# EasyEDA Pro project MORSEY_SOURCE.epro

# Schematic Schematic1
Board Name: Board1; Create Date: 2026-06-15; Page Name: P1; Project Name: MORSE CODE; Schematic Name: Schematic1; Update Date: 2026-06-15; Company: EasyEDA.com; Page Size: A4; Version: V1.0
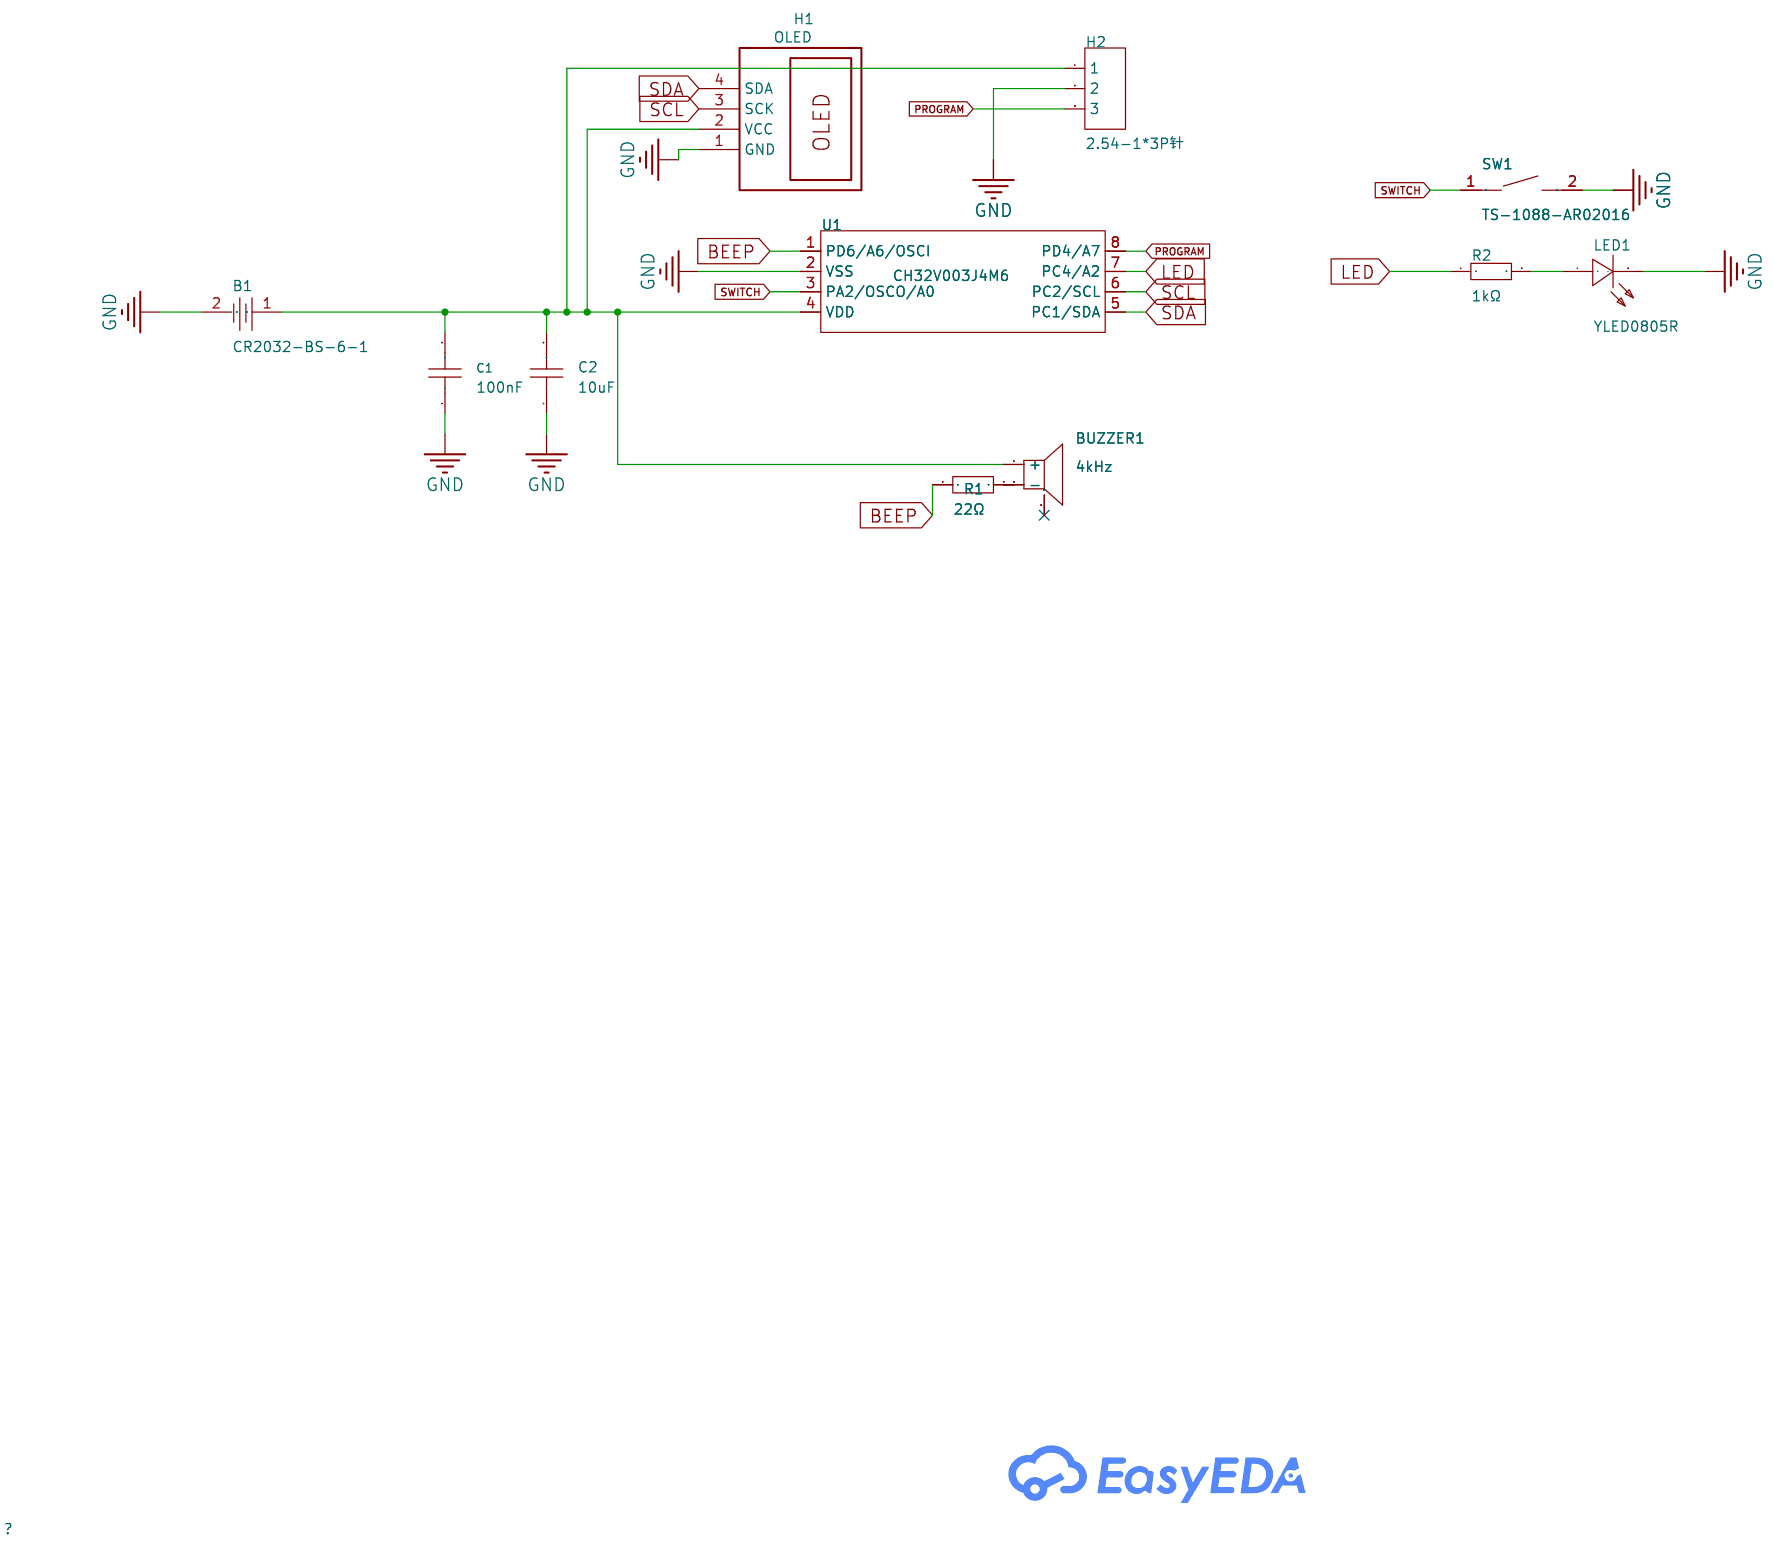
[diagram p0: schematic sheet]

## Parts
B1  CR2032-BS-6-1  [BAT-TH_CR2032-BS-6-1]
BUZZER1  4kHz  [BUZ-SMD_3P-L5.2-W5.2-P3.50-BR]
C1  100nF  [C0603]
C2  10uF  [C0603]
H1  OLED
H2  2.54-1*3P针  [HDR-TH_3P-P2.54-V-M-1]
LED1  YLED0805R  [LED0805-R-RD_RED]
R1  22Ω  [R0603]
R2  1kΩ  [R0603]
SW1  TS-1088-AR02016  [SW-SMD_L3.9-W3.0-P4.45]
U1  CH32V003J4M6  [SOP-8_L4.9-W3.8-P1.27-LS6.0-BL]

## Library data of the parts
B1 = CR2032-BS-6-1: Type:Battery base Contact material:Phosphor bronze Applicable battery specifications:CR2032; LCSC Part Name: 电池底座 CR2032-BS-6-1; Supplier Part: C70377; Manufacturer: QIJEY; JLCPCB Part Class: Extended Part; Datasheet: https://item.szlcsc.com/datasheet/CR2032-BS-6-1/71472.html; Supplier: LCSC; Type: Battery base; Contact material: Phosphor bronze; Applicable battery specifications: CR2032
BUZZER1 = MLT-5030: Driver Circuitry:Passive (Externally Driven) Technology:Electromagnetic Voltage Rating:3V Voltage - Supply:2V~4V Voltage - Supply:2V~4V Frequency:4kHz Current Consumption:100mA Sound Pressure Level(SPL):80dB Length:5.2mm Width:5.2mm Height:3.4mm Operating; LCSC Part Name: 无源(外部驱动) 电磁式 4kHz; Supplier Part: C95297; Manufacturer: 华能; Supplier Footprint: SMD,5.2x5.7mm; JLCPCB Part Class: Extended Part; Datasheet: https://item.szlcsc.com/datasheet/MLT-5030/96499.html; Supplier: LCSC; Driver Circuitry: Passive (Externally Driven); Technology: Electromagnetic; Voltage Rating: 3V; Voltage - Supply: 2V~4V; Current Consumption: 100mA; Sound Pressure Level(SPL): 80dB; Length: 5.2mm; Width: 5.2mm; Height: 3.4mm; Operating Temperature: -20℃~+70℃
C1 = CL10B104KB8NNNC: Capacitance:100nF Tolerance:±10% Tolerance:±10% Voltage Rating:50V Temperature Coefficient:X7R; LCSC Part Name: 100nF ±10% 50V; Supplier Part: C1591; Manufacturer: SAMSUNG(三星); Supplier Footprint: 0603; JLCPCB Part Class: Extended Part; Datasheet: https://item.szlcsc.com/datasheet/CL10B104KB8NNNC/1943.html; Supplier: LCSC; Tolerance: ±10%; Voltage Rating: 50V; Temperature Coefficient: X7R
C2 = CL10A106KP8NNNC: Capacitance:10uF Tolerance:±10% Tolerance:±10% Voltage Rating:10V Temperature Coefficient:X5R; LCSC Part Name: 10uF ±10% 10V; Supplier Part: C19702; Manufacturer: SAMSUNG(三星); Supplier Footprint: 0603; Datasheet: https://item.szlcsc.com/datasheet/CL10A106KP8NNNC/20411.html; Supplier: LCSC; Tolerance: ±10%; Voltage Rating: 10V; Temperature Coefficient: X5R
H1 = OLED: Manufacturer Part: SSD1306 I2C OLED; Contributor: stozk; spicePre: U
H2 = 2.54-1*3P针: Pin Structure:1x3P Pitch:2.54mm Row Spacing:- Circluar Pins/Square Pins:Pin Header Mounting Type:Through Hole Number of Rows:1 Number of Pins:3P Current Rating:3A Voltage Rating (Max):- Length of Mating Pin:6mm Insulation Height:2.5mm Length of End Connec; LCSC Part Name: 1x3P 间距:2.54mm 方针 直插; Supplier Part: C49257; Manufacturer: BOOMELE(博穆精密); Supplier Footprint: 插件,P=2.54mm; JLCPCB Part Class: Extended Part; Datasheet: https://item.szlcsc.com/datasheet/2.54-1*3P%25E9%2592%2588/50265.html; Supplier: LCSC; Pin Structure: 1x3P; Pitch: 2.54mm; Circluar Pins/Square Pins: Pin Header; Mounting Type: Through Hole; Number of Rows: 1; Number of Pins: 3P; Current Rating: 3A; Length of Mating Pin: 6mm; Insulation Height: 2.5mm; Length of End Connection Pin: 3mm; Contact Material: Brass; Contact Plating: Gold; Operating Temperature: -40℃~+105℃; Color: Black
LED1 = YLED0805R: Emitted Color:Red Forward Voltage (VF):1.8V~2.4V Forward Voltage (VF):1.8V~2.4V Power Dissipation:60mW Forward Current:20mA Dominant Wavelength:615nm~630nm Dominant Wavelength:615nm~630nm Peak Wavelength:645nm Diode Configuration:- Lens Color:- Color Temp; Supplier Part: C19171391; Manufacturer: YONGYUTAI(永裕泰); Supplier Footprint: 0805; Datasheet: https://atta.szlcsc.com/upload/public/pdf/source/20231027/AB486D22E6D71BC59190C48A798367E6.pdf; Supplier: LCSC; Emitted Color: Red; Forward Voltage (VF): 1.8V~2.4V; Power Dissipation: 60mW; Forward Current: 20mA; Dominant Wavelength: 615nm~630nm; Peak Wavelength: 645nm; Operating Temperature: -40℃~+85℃
R1 = WR06X22R0FTL: Type:Thick Film Resistor Resistance:22Ω Tolerance:±1% Tolerance:±1% Power(Watts):100mW Voltage-Supply(Max):75V Temperature Coefficient:±100ppm/℃ Temperature Coefficient:±100ppm/℃ Operating Temperature:-55℃~+155℃ Operating Temperature:-55℃~+155℃; LCSC Part Name: 厚膜电阻 22Ω ±1% 100mW; Supplier Part: C163887; Manufacturer: Walsin(华新科); Supplier Footprint: 0603; Datasheet: https://item.szlcsc.com/datasheet/WR06X22R0FTL/175269.html; Supplier: LCSC; Type: Thick Film Resistor; Tolerance: ±1%; Power(Watts): 100mW; Voltage-Supply(Max): 75V; Temperature Coefficient: ±100ppm/℃; Operating Temperature: -55℃~+155℃
R2 = RT0603BRD071KL: Type:Thin Film Resistor Resistance: Tolerance:±0.1% Tolerance:±0.1% Power(Watts): Overload Voltage (Max): Temperature Coefficient:±25ppm/℃ Temperature Coefficient:±25ppm/℃ Operating Temperature Range:-55℃~+155℃ Operating Temperature Range:-55℃~+155℃; LCSC Part Name: 薄膜电阻 1kΩ ±0.1% 100mW; Supplier Part: C110776; Manufacturer: YAGEO(国巨); Supplier Footprint: 0603; JLCPCB Part Class: Extended Part; Datasheet: https://atta.szlcsc.com/upload/public/pdf/source/20170704/1499151282044.pdf; Supplier: LCSC; Type: Thin Film Resistor; Tolerance: ±0.1%; Temperature Coefficient: ±25ppm/℃; Operating Temperature Range: -55℃~+155℃
SW1 = TS-1088-AR02016: Circuit:SPST Actuator Style:Round Button Operating Force:1.6N Mounting Type:Surface Mount,Vertical Length:4mm Width:3mm Switch Height:2mm with Bracket:Without Bracket Contact Current:50mA Voltage Rating:12V Actuator/Cap Color:Black Termination Style:SMD(S; LCSC Part Name: 4*3*2mm 立贴 轻触开关; Supplier Part: C720477; Manufacturer: XUNPU(讯普); Supplier Footprint: SMD,4x3mm; Datasheet: https://item.szlcsc.com/datasheet/TS-1088-AR02016/763484.html; Supplier: LCSC; Circuit: SPST; Actuator Style: Round Button; Operating Force: 1.6N; Mounting Type: Surface Mount,Vertical; Length: 4mm; Width: 3mm; Switch Height: 2mm; with Bracket: Without Bracket; Contact Current: 50mA; Voltage Rating: 12V; Actuator/Cap Color: Black; Termination Style: SMD(SMT) Tab; Life: 100,000 Cycles; Operating Temperature: -30℃~+80℃
U1 = CH32V003J4M6_C5346354: Features:-; LCSC Part Name: QingKe V2微处理器; Supplier Part: C5346354; Manufacturer: WCH(南京沁恒); Supplier Footprint: SOP-8; Datasheet: https://item.szlcsc.com/datasheet/CH32V003J4M6/6127776.html; Supplier: LCSC

## Nets
GND: B1.2 C1.1 C2.1 H1.1(GND) H2.2 LED1.2(-) SW1.2 U1.2(VSS)
BEEP: R1.1 U1.1(PD6/A6/OSCI)
LED: R2.1 U1.7(PC4/A2)
PROGRAM: H2.3 U1.8(PD4/A7)
SCL: H1.3(SCK) U1.6(PC2/SCL)
SDA: H1.4(SDA) U1.5(PC1/SDA)
SWITCH: SW1.1 U1.3(PA2/OSCO/A0)
Net-(B1-1): B1.1 BUZZER1.2(+) C1.2 C2.2 H1.2(VCC) H2.1 U1.4(VDD)
Net-(BUZZER1-3): BUZZER1.3(-) R1.2
Net-(LED1-1): LED1.1(+) R2.2

Not connected (* = marked no-connect by the designer): BUZZER1 1(NC)*

# Schematic Schematic1_1
Board Name: PCB2; Create Date: 2026-06-16; Page Name: P1; Project Name: MORSE CODE; Schematic Name: Schematic1_1; Update Date: 2026-06-16; Company: EasyEDA.com; Page Size: A4; Version: V1.0
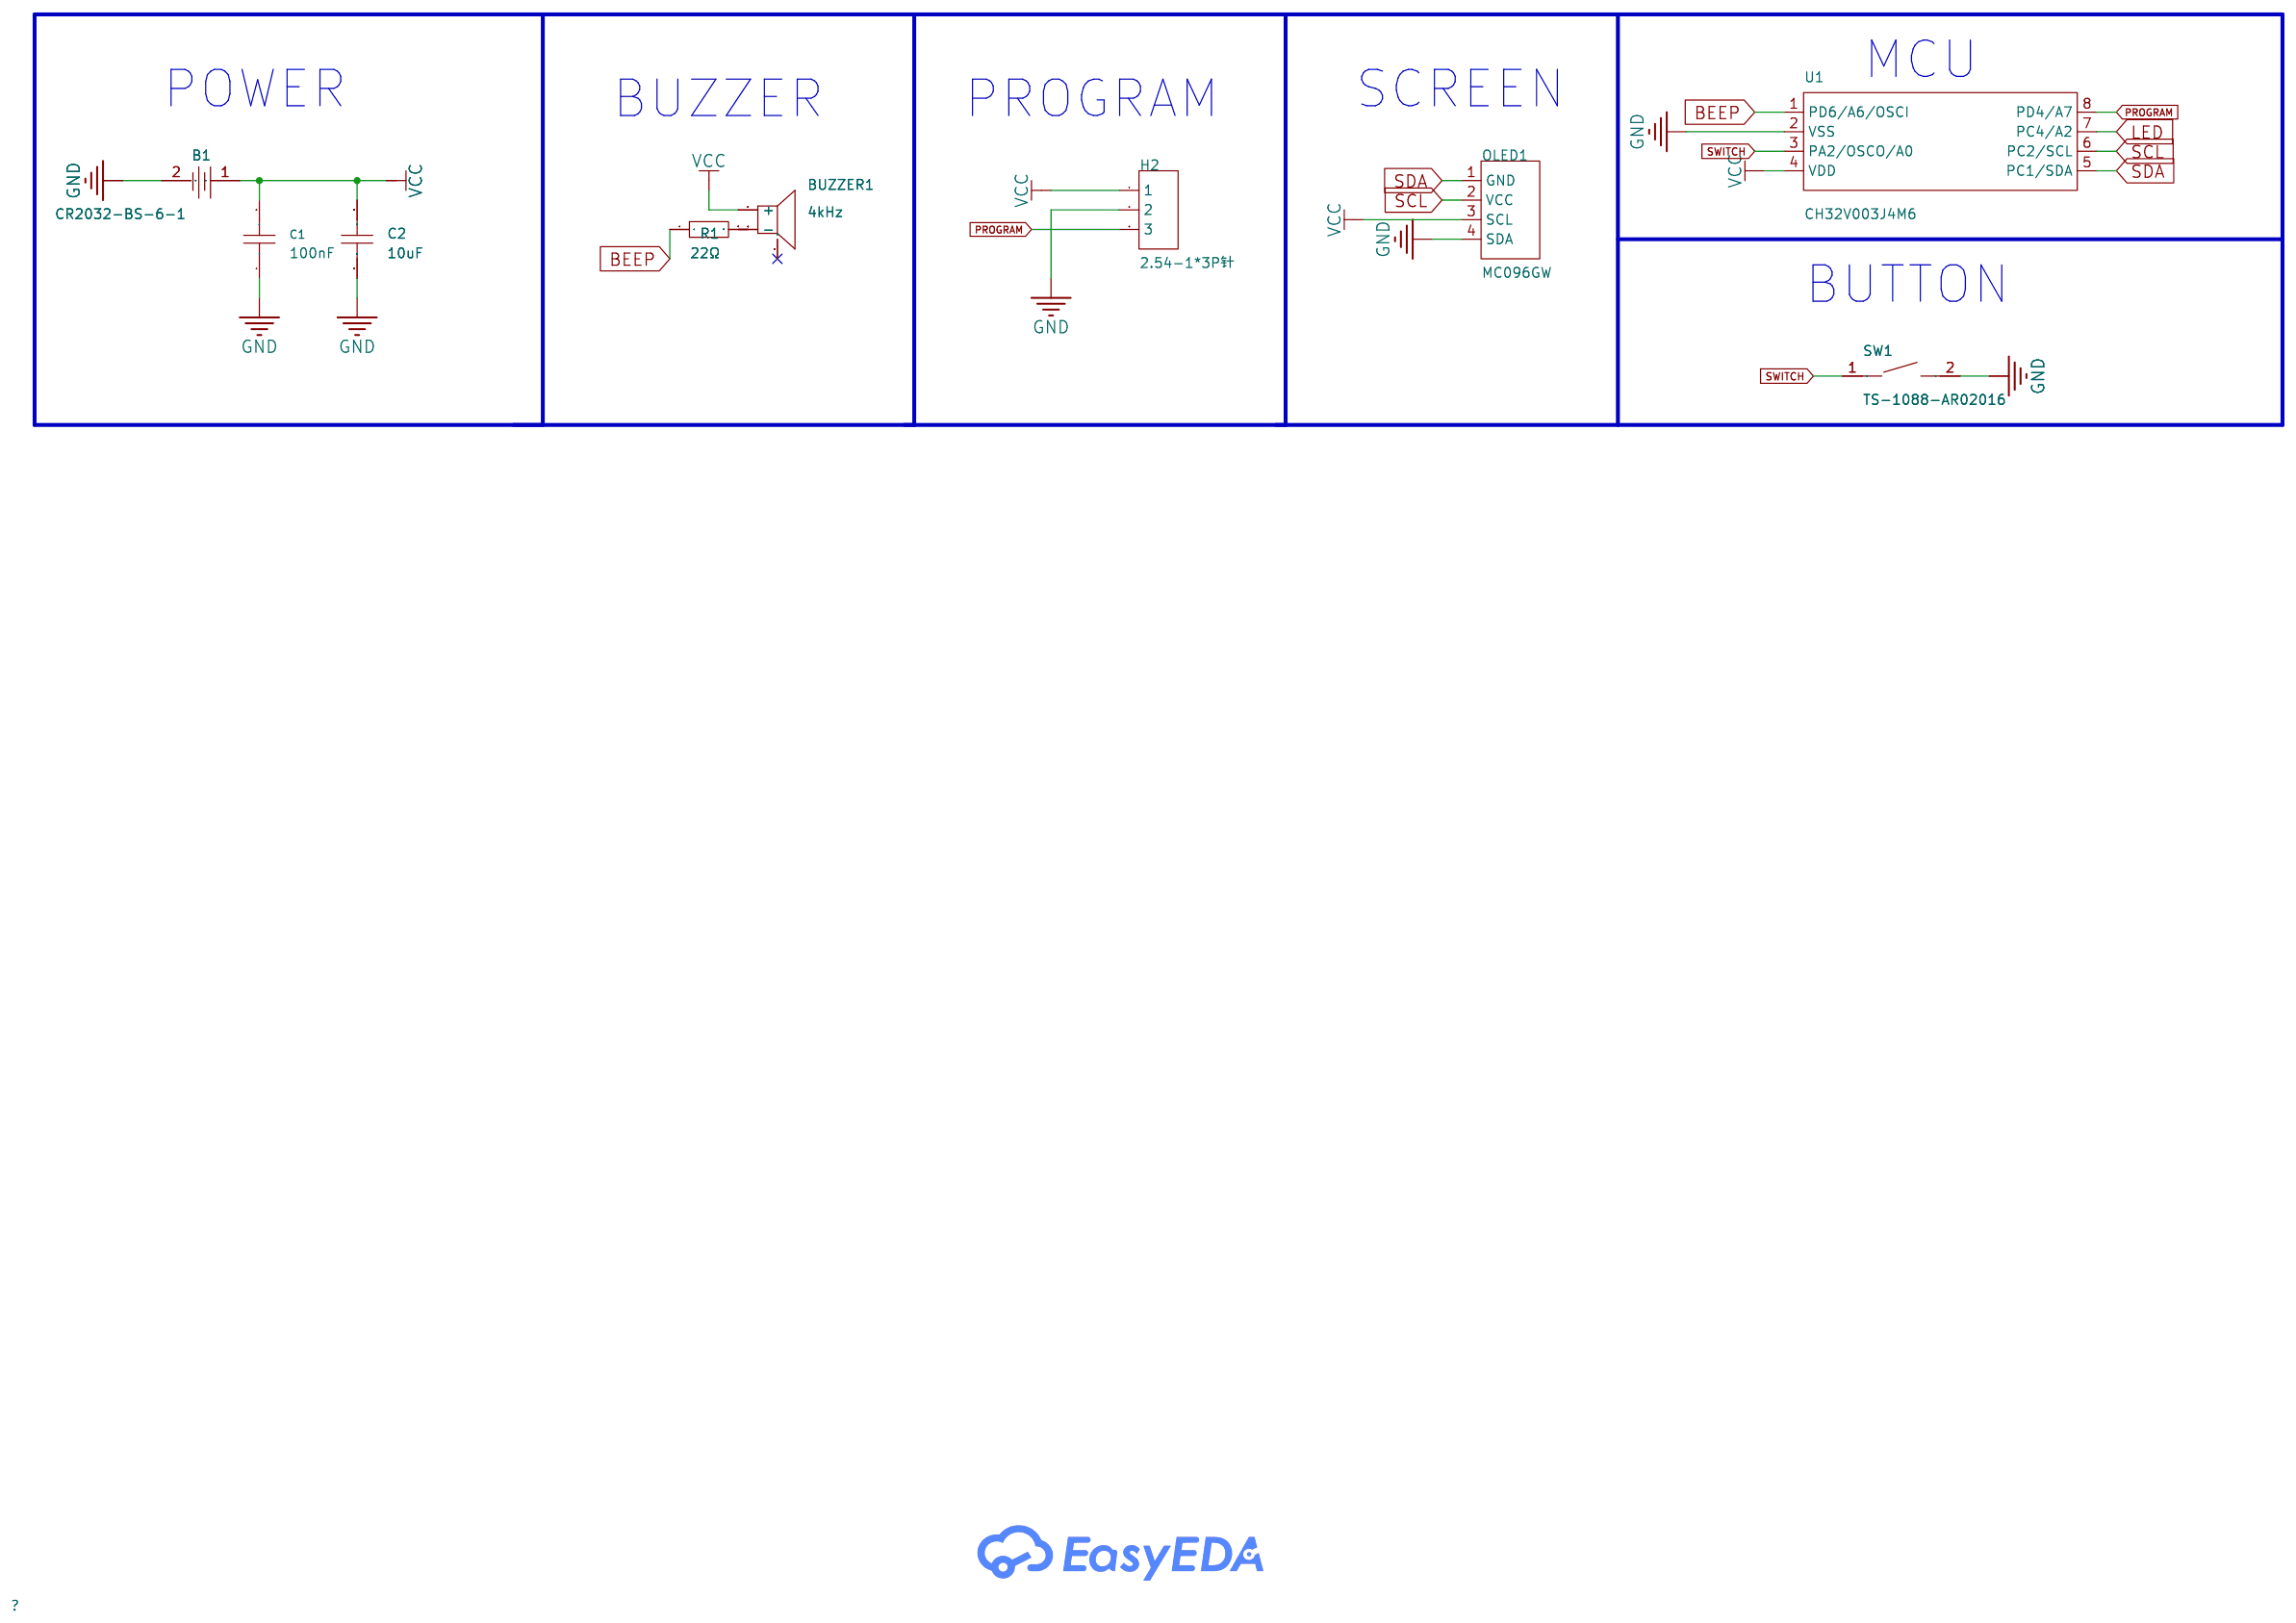
[diagram p1: schematic sheet]

## Parts
B1  CR2032-BS-6-1  [BAT-TH_CR2032-BS-6-1]
BUZZER1  4kHz  [BUZ-SMD_3P-L5.2-W5.2-P3.50-BR]
C1  100nF  [C0603]
C2  10uF  [C0603]
H2  2.54-1*3P针  [HDR-TH_3P-P2.54-V-M-1]
OLED1  MC096GW  [OLED-TH_4P-L27.8-W27.3_MC096GW]
R1  22Ω  [R0603]
SW1  TS-1088-AR02016  [SW-SMD_L3.9-W3.0-P4.45]
U1  CH32V003J4M6  [SOP-8_L4.9-W3.8-P1.27-LS6.0-BL]

## Library data of the parts
B1 = CR2032-BS-6-1: Type:Battery base Contact material:Phosphor bronze Applicable battery specifications:CR2032; LCSC Part Name: 电池底座 CR2032-BS-6-1; Supplier Part: C70377; Manufacturer: QIJEY; JLCPCB Part Class: Extended Part; Datasheet: https://item.szlcsc.com/datasheet/CR2032-BS-6-1/71472.html; Supplier: LCSC; Type: Battery base; Contact material: Phosphor bronze; Applicable battery specifications: CR2032
BUZZER1 = MLT-5030: Driver Circuitry:Passive (Externally Driven) Technology:Electromagnetic Voltage Rating:3V Voltage - Supply:2V~4V Voltage - Supply:2V~4V Frequency:4kHz Current Consumption:100mA Sound Pressure Level(SPL):80dB Length:5.2mm Width:5.2mm Height:3.4mm Operating; LCSC Part Name: 无源(外部驱动) 电磁式 4kHz; Supplier Part: C95297; Manufacturer: 华能; Supplier Footprint: SMD,5.2x5.7mm; JLCPCB Part Class: Extended Part; Datasheet: https://item.szlcsc.com/datasheet/MLT-5030/96499.html; Supplier: LCSC; Driver Circuitry: Passive (Externally Driven); Technology: Electromagnetic; Voltage Rating: 3V; Voltage - Supply: 2V~4V; Current Consumption: 100mA; Sound Pressure Level(SPL): 80dB; Length: 5.2mm; Width: 5.2mm; Height: 3.4mm; Operating Temperature: -20℃~+70℃
C1 = CL10B104KB8NNNC: Capacitance:100nF Tolerance:±10% Tolerance:±10% Voltage Rating:50V Temperature Coefficient:X7R; LCSC Part Name: 100nF ±10% 50V; Supplier Part: C1591; Manufacturer: SAMSUNG(三星); Supplier Footprint: 0603; JLCPCB Part Class: Extended Part; Datasheet: https://item.szlcsc.com/datasheet/CL10B104KB8NNNC/1943.html; Supplier: LCSC; Tolerance: ±10%; Voltage Rating: 50V; Temperature Coefficient: X7R
C2 = CL10A106KP8NNNC: Capacitance:10uF Tolerance:±10% Tolerance:±10% Voltage Rating:10V Temperature Coefficient:X5R; LCSC Part Name: 10uF ±10% 10V; Supplier Part: C19702; Manufacturer: SAMSUNG(三星); Supplier Footprint: 0603; Datasheet: https://item.szlcsc.com/datasheet/CL10A106KP8NNNC/20411.html; Supplier: LCSC; Tolerance: ±10%; Voltage Rating: 10V; Temperature Coefficient: X5R
H2 = 2.54-1*3P针: Pin Structure:1x3P Pitch:2.54mm Row Spacing:- Circluar Pins/Square Pins:Pin Header Mounting Type:Through Hole Number of Rows:1 Number of Pins:3P Current Rating:3A Voltage Rating (Max):- Length of Mating Pin:6mm Insulation Height:2.5mm Length of End Connec; LCSC Part Name: 1x3P 间距:2.54mm 方针 直插; Supplier Part: C49257; Manufacturer: BOOMELE(博穆精密); Supplier Footprint: 插件,P=2.54mm; JLCPCB Part Class: Extended Part; Datasheet: https://item.szlcsc.com/datasheet/2.54-1*3P%25E9%2592%2588/50265.html; Supplier: LCSC; Pin Structure: 1x3P; Pitch: 2.54mm; Circluar Pins/Square Pins: Pin Header; Mounting Type: Through Hole; Number of Rows: 1; Number of Pins: 3P; Current Rating: 3A; Length of Mating Pin: 6mm; Insulation Height: 2.5mm; Length of End Connection Pin: 3mm; Contact Material: Brass; Contact Plating: Gold; Operating Temperature: -40℃~+105℃; Color: Black
OLED1 = MC096GW: Supplier Part: C9900209498; Supplier Footprint: OLED-TH; Supplier: LCSC
R1 = WR06X22R0FTL: Type:Thick Film Resistor Resistance:22Ω Tolerance:±1% Tolerance:±1% Power(Watts):100mW Voltage-Supply(Max):75V Temperature Coefficient:±100ppm/℃ Temperature Coefficient:±100ppm/℃ Operating Temperature:-55℃~+155℃ Operating Temperature:-55℃~+155℃; LCSC Part Name: 厚膜电阻 22Ω ±1% 100mW; Supplier Part: C163887; Manufacturer: Walsin(华新科); Supplier Footprint: 0603; Datasheet: https://item.szlcsc.com/datasheet/WR06X22R0FTL/175269.html; Supplier: LCSC; Type: Thick Film Resistor; Tolerance: ±1%; Power(Watts): 100mW; Voltage-Supply(Max): 75V; Temperature Coefficient: ±100ppm/℃; Operating Temperature: -55℃~+155℃
SW1 = TS-1088-AR02016: Circuit:SPST Actuator Style:Round Button Operating Force:1.6N Mounting Type:Surface Mount,Vertical Length:4mm Width:3mm Switch Height:2mm with Bracket:Without Bracket Contact Current:50mA Voltage Rating:12V Actuator/Cap Color:Black Termination Style:SMD(S; LCSC Part Name: 4*3*2mm 立贴 轻触开关; Supplier Part: C720477; Manufacturer: XUNPU(讯普); Supplier Footprint: SMD,4x3mm; Datasheet: https://item.szlcsc.com/datasheet/TS-1088-AR02016/763484.html; Supplier: LCSC; Circuit: SPST; Actuator Style: Round Button; Operating Force: 1.6N; Mounting Type: Surface Mount,Vertical; Length: 4mm; Width: 3mm; Switch Height: 2mm; with Bracket: Without Bracket; Contact Current: 50mA; Voltage Rating: 12V; Actuator/Cap Color: Black; Termination Style: SMD(SMT) Tab; Life: 100,000 Cycles; Operating Temperature: -30℃~+80℃
U1 = CH32V003J4M6_C5346354: Features:-; LCSC Part Name: QingKe V2微处理器; Supplier Part: C5346354; Manufacturer: WCH(南京沁恒); Supplier Footprint: SOP-8; Datasheet: https://item.szlcsc.com/datasheet/CH32V003J4M6/6127776.html; Supplier: LCSC

## Nets
GND: B1.2 C1.1 C2.1 H2.2 OLED1.4(SDA) SW1.2 U1.2(VSS)
VCC: B1.1 BUZZER1.2(+) C1.2 C2.2 H2.1 OLED1.3(SCL) U1.4(VDD)
BEEP: R1.1 U1.1(PD6/A6/OSCI)
LED: U1.7(PC4/A2)
PROGRAM: H2.3 U1.8(PD4/A7)
SCL: OLED1.2(VCC) U1.6(PC2/SCL)
SDA: OLED1.1(GND) U1.5(PC1/SDA)
SWITCH: SW1.1 U1.3(PA2/OSCO/A0)
$1N1241: BUZZER1.3(-) R1.2

Not connected (* = marked no-connect by the designer): BUZZER1 1(NC)*

## Notes on the sheet
- MCU
- POWER
- SCREEN
- BUZZER
- PROGRAM
- BUTTON

# Board PCB2
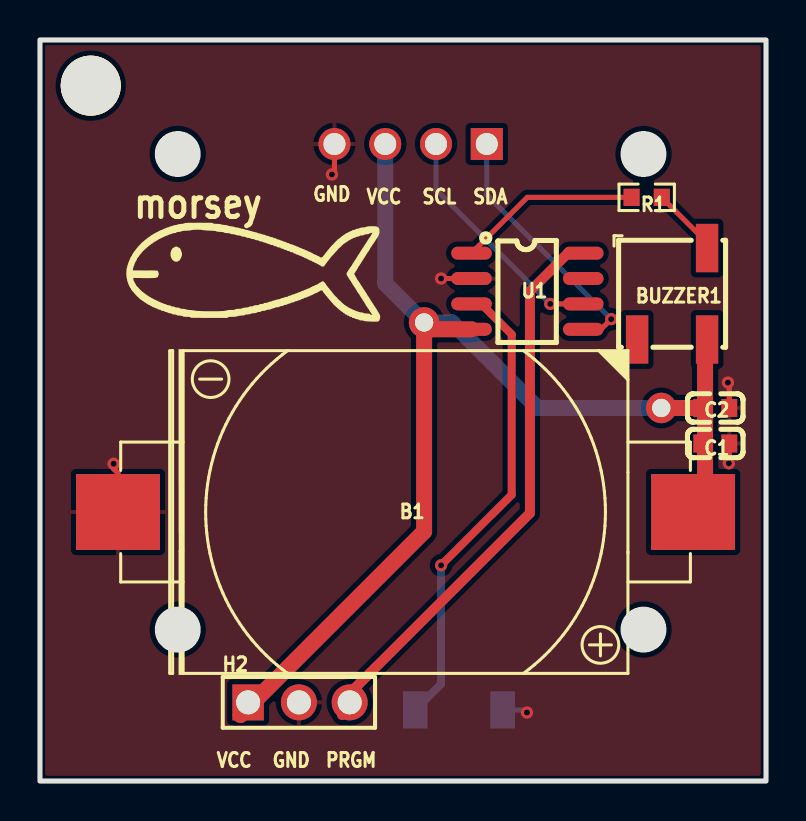
[diagram p2: board, top side]
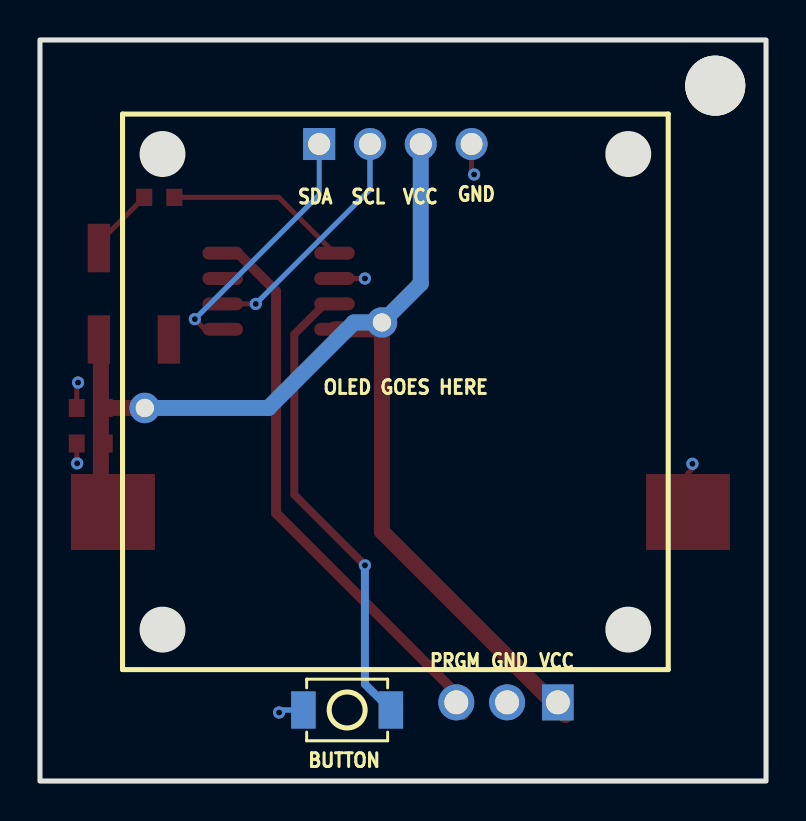
[diagram p3: board, bottom side, seen from below]

Outline 36.32 x 37.08 mm; copper layers: Top Layer, Bottom Layer. Coordinates in mm from the lower left corner of the outline.
Outline path: rectangle 0,37.08 36.32,0
Stack: Top Layer 0.035mm / Dielectric1 1.51mm FR4 er 4.5 / Bottom Layer 0.035mm

## Design rules (mm)
template: JLCPCB Capability(Two Layers Board)
spacing copperThickness1oz (default): track to track 0.102, other pairs 0.152 to 0.3
spacing copperThickness2oz: track to track 0.203, other pairs 0.152 to 0.3
track width copperThickness1oz (default): min 0.127, default 0.254, max 2.54
track width copperThickness2oz: min 0.203, default 0.254, max 2.54
differential pair differentialPair (default): width min 0.127, default 0.254, max 2.54; gap min 0.152, default 0.152
via viaSize (default): diameter min 0.5, default 0.61, max 10; hole min 0.3, default 0.305, max 6.3

## Placement (name value [footprint] x y rotation side)
B1  CR2032-BS-6-1  [BAT-TH_CR2032-BS-6-1]  18.29 13.46 0 top
BUTTON  TS-1088-AR02016  [SW-SMD_L3.9-W3.0-P4.45]  20.95 3.56 0 bottom
BUZZER1  4kHz  [BUZ-SMD_3P-L5.2-W5.2-P3.50-BR]  31.62 24.38 180 top
C1  100nF  [C0603]  33.78 16.89 180 top
C2  10uF  [C0603]  33.78 18.67 180 top
H2  2.54-1*3P针  [HDR-TH_3P-P2.54-V-M-1]  12.95 3.94 0 top
NOREF  -  [Pad_e81]  31.08 18.67 0 top
NOREF#2  -  [Pad_e123]  19.22 22.95 0 top
NOREF#3  -  [Pad_e259]  2.54 34.8 0 top
OLED GOES HERE  MC096GW  [OLED-TH_4P-L27.8-W27.3_MC096GW]  18.54 31.88 180 bottom
R1  22Ω  [R0603]  30.35 29.21 0 top
U1  CH32V003J4M6  [SOP-8_L4.9-W3.8-P1.27-LS6.0-BL]  24.38 24.51 270 top

## Footprints (pads in the part's own frame, mm; a bottom-side part is the same pattern mirrored in y, then rotated)
BAT-TH_CR2032-BS-6-1
  rect 4.2x3.8 smd: 1(14.385,0) 2(-14.385,0)
BUZ-SMD_3P-L5.2-W5.2-P3.50-BR
  rect 1.12x2.425 smd: 1(1.75,2.288) 2(-1.75,2.288) 3(-1.75,-2.288)
C0603
  rect 0.8x0.9 smd: 1(-0.7,0) 2(0.7,0)
HDR-TH_3P-P2.54-V-M-1
  rect 1.575x1.8 hole 1.2: 1(-2.54,0)
  round 1.8 hole 1.2: 2(0,0) 3(2.54,0)
OLED-TH_4P-L27.8-W27.3_MC096GW
  rect 1.6x1.6 hole 1.1: 1(-3.81,0)
  round 1.6 hole 1.1: 2(-1.27,0) 3(1.27,0) 4(3.81,0)
Pad_e81
  round 1.524 hole 0.914: 1(0,0)
Pad_e123
  round 1.524 hole 0.914: 1(0,0)
Pad_e259
  round 3 hole 4x3: 1(0,0)
R0603
  rect 0.806x0.864 smd: 1(-0.753,0) 2(0.753,0)
SOP-8_L4.9-W3.8-P1.27-LS6.0-BL
  oval 0.65x2.032 smd: 1(-1.905,-2.796) 2(-0.635,-2.796) 3(0.635,-2.796) 4(1.905,-2.796) 5(1.905,2.796) 6(0.635,2.796) 7(-0.635,2.796) 8(-1.905,2.796)
SW-SMD_L3.9-W3.0-P4.45
  rect 1.23x1.86 smd: 1(-2.185,0) 2(2.185,0)

## Nets
GND: B1.2 BUTTON.2 C1.1 C2.1 H2.2 OLED GOES HERE.4 U1.2
VCC: B1.1 BUZZER1.2 C1.2 C2.2 H2.1 NOREF.1 NOREF#2.1 OLED GOES HERE.3 U1.4
BEEP: R1.1 U1.1
LED: U1.7
PROGRAM: H2.3 U1.8
SCL: OLED GOES HERE.2 U1.6
SDA: OLED GOES HERE.1 U1.5
SWITCH: BUTTON.1 U1.3
$1N1241: BUZZER1.3 R1.2

Pads without a net: BUZZER1 1; NOREF#3 1

## Via types
v1: diameter 0.61, hole 0.305, Top Layer to Bottom Layer, 9 vias

## Routing (per net, layer and track width the routed paths; a pad name or vN(x,y) marks a point on that pad's centre or on a via; arc(x,y) is an arc through that point)
GND: length 9.2
  Top Layer w0.254: C2.1 34.48,19.87 v1(34.42,19.94) ; B1.2 3.9,15.4 3.68,15.62 v1(3.68,15.88) ; v1(14.61,30.35) 14.73,30.48 OLED GOES HERE.4 ; C1.1 34.48,15.92 v1(34.46,15.9) ; U1.2 v1(20.07,25.15)
  Bottom Layer w0.254: BUTTON.2 24.23,3.56 v1(24.36,3.43)
VCC: length 61.3
  Top Layer w0.8: 33.18,12.19 33.27,12.28 33.27,22 BUZZER1.2 ; 10.03,3.3 19.22,12.48 NOREF#2.1 19.56,22.61 U1.4 ; C2.2 NOREF.1
  Bottom Layer w0.8: NOREF.1 24.89,18.67 20.61,22.95 NOREF#2.1 17.27,24.89 OLED GOES HERE.3
BEEP: length 9.2
  Top Layer w0.254: R1.1 24.38,29.21 U1.1
PROGRAM: length 28.6
  Top Layer w0.5: U1.8 26.42,26.42 24.51,24.51 24.51,13.41 15.11,4.01 15.11,3.3
SCL: length 12
  Top Layer w0.254: U1.6 v1(25.53,23.88)
  Bottom Layer w0.254: v1(25.53,23.88) 19.81,29.59 OLED GOES HERE.2
SDA: length 12.9
  Top Layer w0.254: v1(28.58,23.11) 28.07,22.61 U1.5
  Bottom Layer w0.254: v1(28.58,23.11) 22.35,29.34 OLED GOES HERE.1
SWITCH: length 23.4
  Top Layer w0.4: U1.3 22.07,23.88 23.6,22.35 23.6,14.33 v1(20.07,10.8)
  Bottom Layer w0.4: BUTTON.1 20.07,4.85 v1(20.07,10.8)
$1N1241: length 3.5
  Top Layer w0.254: BUZZER1.3 33.37,26.94 R1.2

## Copper pours and planes (outline as drawn; the poured copper is in the pictures)
GND on Top Layer: 0,37.08 36.32,37.08 36.32,0 0,0
GND on Bottom Layer: -0.13,37.08 36.32,37.08 36.32,0 -0.13,0

## Text on the board
Bottom Silkscreen Layer: VCC | GND | PRGM | SCL | SDA
Top Silkscreen Layer: VCC | GND | PRGM | SCL | SDA | morsey
